# Altium schematic sheet Sheet4.SchDoc
size A4; SheetNumber: 1; SheetTotal: 1
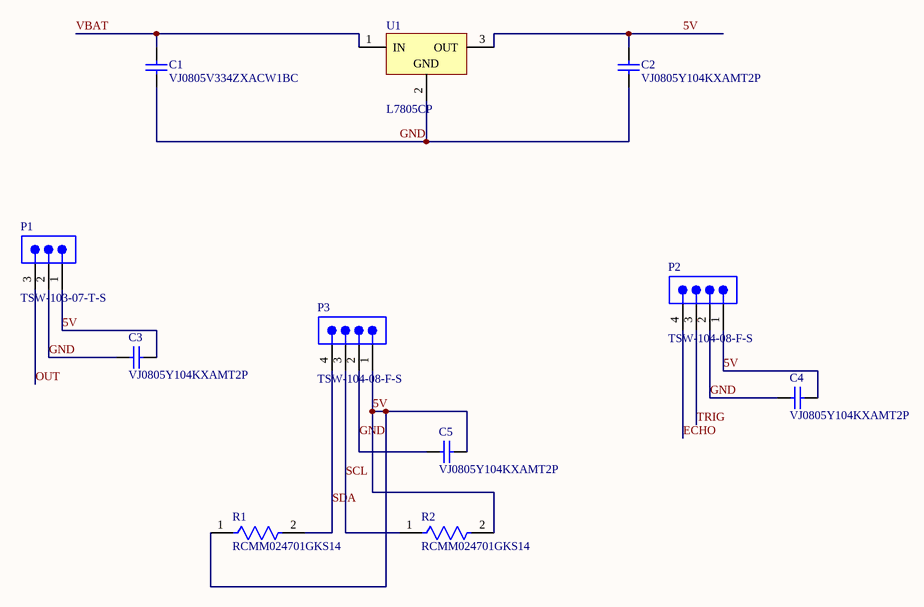
[diagram p0: Sheet4.SchDoc]

## Parts
C1  VJ0805V334ZXACW1BC  [CAPC2013X145X50NL20T20]
C2  VJ0805Y104KXAMT2P  [CAPC2013X145X48LL20T23]
C3  VJ0805Y104KXAMT2P  [CAPC2013X145X48LL20T23]
C4  VJ0805Y104KXAMT2P  [CAPC2013X145X48LL20T23]
C5  VJ0805Y104KXAMT2P  [CAPC2013X145X48LL20T23]
P1  TSW-103-07-T-S  [SMTC-TSW-103-07-X-S]
P2  TSW-104-08-F-S  [SMTC-TSW-104-08-X-S]
P3  TSW-104-08-F-S  [SMTC-TSW-104-08-X-S]
R1  RCMM024701GKS14  [FP-RCMM02-MFG]
R2  RCMM024701GKS14  [FP-RCMM02-MFG]
U1  L7805CP  [TO220FP]

## Nets
5V: C2.2 C3.2 C4.2 C5.2 P1.1 P2.1 P3.1 R1.1 R2.2 U1.3(OUT)
ECHO: P2.4
GND: C1.1 C2.1 C3.1 C4.1 C5.1 P1.2 P2.2 P3.2 U1.2(GND)
OUT: P1.3
SCL: P3.3 R2.1
SDA: P3.4 R1.2
TRIG: P2.3
VBAT: C1.2 U1.1(IN)

## Library data of the parts
C1 = CMP-2007-01320-1: Manufacturer: Vitramon; Part Number: VJ0805V334ZXACW1BC
C2-C5 = CMP-2007-02027-1: Manufacturer: Vishay; Part Number: VJ0805Y104KXAMT2P
P1 = CMP-1024-00332-1: 0.025" SQ Post Header, Through-hole, Vertical, -55 to 105 degC, 2.54 mm Pitch, 3-Pin, Male, RoHS; Manufacturer: Samtec; Pitch: 2.54 mm; ComponentLink1URL: http://www.samtec.com; ComponentLink3URL: http://www.samtec.com/documents/webfiles/cpdf/TSW-XXX-XX-XXX-X-XX-XXX-MKT.pdf; PartNumber: TSW-103-07-T-S; Mounting Technology: Through-hole; RoHS: True; DatasheetVersion: F-214; PackageVersion: DM, 8/1988; Temperature Range: -55 to 105 degC; ComponentLink2Description: Datasheet; ComponentLink1Description: Manufacturer URL; Orientation: Vertical; PackageReference: TSW-103-07-X-S; ComponentLink3Description: Package Specification; ComponentLink2URL: http://www.samtec.com/documents/webfiles/pdf/TSW_TH.PDF; PackageDescription: .025[0.64] SQ. Post Terminal Strip Assembly
P2 P3 = CMP-1024-00355-1: 0.025" SQ Post Header, Through-hole, Vertical, -55 to 125 degC, 2.54 mm Pitch, 4-Pin, Male, RoHS; Manufacturer: Samtec; Pitch: 2.54 mm; Temperature Range: -55 to 125 degC; ComponentLink3URL: http://www.samtec.com/documents/webfiles/cpdf/TSW-XXX-XX-XXX-X-XX-XXX-MKT.pdf; ComponentLink1Description: Manufacturer URL; PackageReference: TSW-104-08-X-S; DatasheetVersion: F-214; Mounting Technology: Through-hole; ComponentLink3Description: Package Specification; PartNumber: TSW-104-08-F-S; PackageVersion: DM, 8/1988; ComponentLink2Description: Datasheet; ComponentLink1URL: http://www.samtec.com; Orientation: Vertical; ComponentLink2URL: http://www.samtec.com/documents/webfiles/pdf/TSW_TH.PDF; RoHS: True; PackageDescription: .025[0.64] SQ. Post Terminal Strip Assembly
R1 R2 = CMP-02408-000034-1: RES 4.7K OHM 2% 1/2W AXIAL; Temperature Coefficient: 100ppm/°C; Resistance: 4.7kR; RoHS Compliant: Yes; Contact Plating: Tin; Tolerance: 2%; Diameter: 2.5mm; Case/Package: Molded; Length: 6.5mm; Mount: Through Hole; Resistor Type: Metal Film
U1 = CMP-0244-00474-1: Positive Voltage Regulator, 5V, 3-Pin TO-220FP; ComponentLink1Description: Manufacturer URL; ComponentLink2Description: Datasheet; DatasheetVersion: 16/11/2011; PackageDescription: TO, Thru-Hole, Vertical, Heatsink Mounted; 3 In-Line Leads; Pitch 2.54 mm; ComponentLink2URL: http://www.st.com/internet/com/TECHNICAL_RESOURCES/TECHNICAL_LITERATURE/DATASHEET/CD00000444.pdf; ComponentLink1URL: http://www.st.com; PackageVersion: 2011; PackageReference: TO220FP